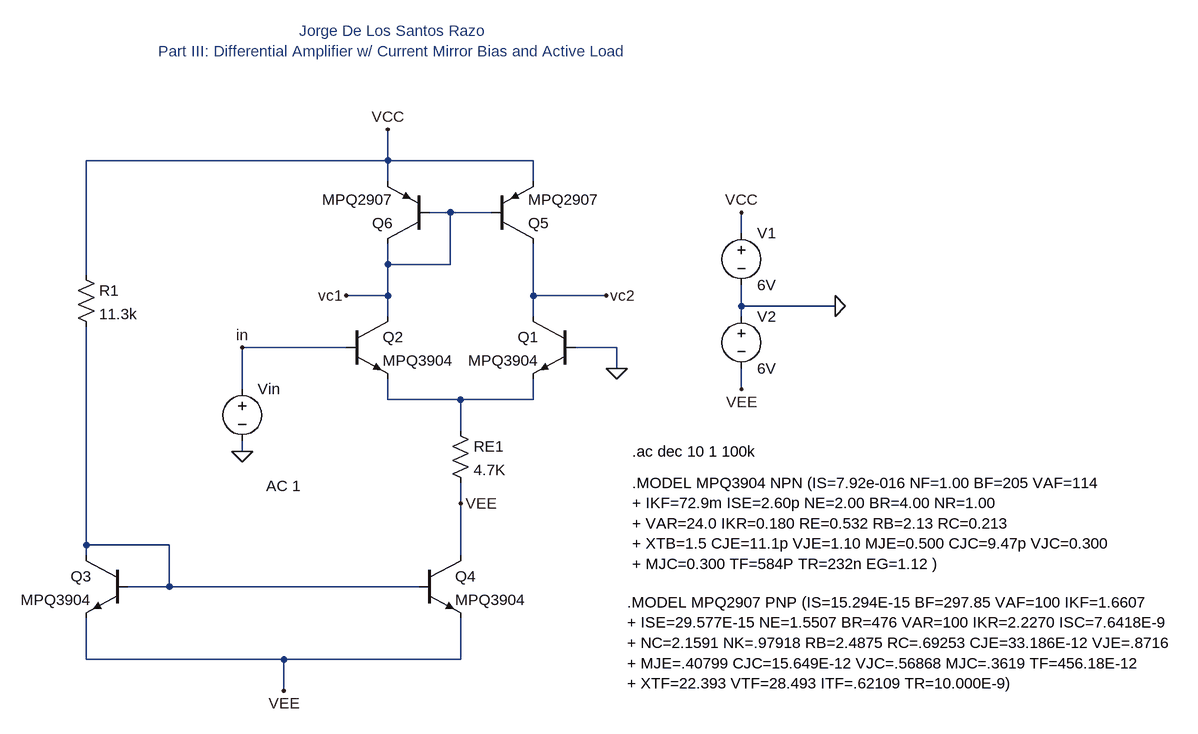
[diagram p0: schematic Diff-Amp-with-Current-Mirror-and-Active-Load.asc]
Diff-Amp-with-Current-Mirror-and-Active-Load.asc, the LTspice schematic file:
Version 4.1
SHEET 1 1960 920
WIRE 512 16 512 -32
WIRE 512 16 48 16
WIRE 736 16 512 16
WIRE 512 48 512 16
WIRE 736 48 736 16
WIRE 608 96 576 96
WIRE 672 96 608 96
WIRE 1056 128 1056 96
WIRE 512 176 512 144
WIRE 608 176 608 96
WIRE 608 176 512 176
WIRE 48 192 48 16
WIRE 512 224 512 176
WIRE 512 224 448 224
WIRE 736 224 736 144
WIRE 848 224 736 224
WIRE 1056 240 1056 208
WIRE 1200 240 1056 240
WIRE 512 256 512 224
WIRE 736 256 736 224
WIRE 1056 256 1056 240
WIRE 448 304 288 304
WIRE 864 304 800 304
WIRE 864 336 864 304
WIRE 288 368 288 304
WIRE 1056 368 1056 336
WIRE 512 384 512 352
WIRE 624 384 512 384
WIRE 736 384 736 352
WIRE 736 384 624 384
WIRE 624 432 624 384
WIRE 288 464 288 448
WIRE 624 544 624 512
WIRE 48 608 48 272
WIRE 176 608 48 608
WIRE 48 624 48 608
WIRE 624 624 624 544
WIRE 176 672 176 608
WIRE 176 672 112 672
WIRE 560 672 176 672
WIRE 48 784 48 720
WIRE 352 784 48 784
WIRE 624 784 624 720
WIRE 624 784 352 784
WIRE 352 832 352 784
FLAG 288 464 0
FLAG 624 544 VEE
FLAG 512 -32 VCC
FLAG 864 336 0
FLAG 1056 368 VEE
FLAG 1056 96 VCC
FLAG 1200 240 0
FLAG 448 224 vc1
FLAG 288 304 in
FLAG 848 224 vc2
FLAG 352 832 VEE
SYMBOL npn 800 256 M0
SYMATTR InstName Q1
SYMATTR Value MPQ3904
SYMBOL npn 448 256 R0
SYMATTR InstName Q2
SYMATTR Value MPQ3904
SYMBOL res 608 416 R0
SYMATTR InstName RE1
SYMATTR Value 4.7K
SYMBOL voltage 288 352 R0
WINDOW 3 37 137 Left 2
WINDOW 123 37 165 Left 2
WINDOW 39 0 0 Left 0
SYMATTR Value ""
SYMATTR Value2 AC 1
SYMATTR InstName Vin
SYMBOL voltage 1056 112 R0
SYMATTR InstName V1
SYMATTR Value 6V
SYMBOL voltage 1056 240 R0
SYMATTR InstName V2
SYMATTR Value 6V
SYMBOL npn 112 624 M0
SYMATTR InstName Q3
SYMATTR Value MPQ3904
SYMBOL npn 560 624 R0
SYMATTR InstName Q4
SYMATTR Value MPQ3904
SYMBOL res 32 176 R0
SYMATTR InstName R1
SYMATTR Value 11.3k
SYMBOL pnp 672 144 M180
SYMATTR InstName Q5
SYMATTR Value MPQ2907
SYMBOL pnp 576 144 R180
SYMATTR InstName Q6
SYMATTR Value MPQ2907
TEXT 888 512 Left 2 !.MODEL MPQ3904 NPN (IS=7.92e-016 NF=1.00 BF=205 VAF=114\n+ IKF=72.9m ISE=2.60p NE=2.00 BR=4.00 NR=1.00\n+ VAR=24.0 IKR=0.180 RE=0.532 RB=2.13 RC=0.213\n+ XTB=1.5 CJE=11.1p VJE=1.10 MJE=0.500 CJC=9.47p VJC=0.300\n+ MJC=0.300 TF=584P TR=232n EG=1.12 )
TEXT 520 -168 Center 2 ;Jorge De Los Santos Razo\nPart III: Differential Amplifier w/ Current Mirror Bias and Active Load
TEXT 888 464 Left 2 !.ac dec 10 1 100k
TEXT 880 696 Left 2 !.MODEL MPQ2907 PNP (IS=15.294E-15 BF=297.85 VAF=100 IKF=1.6607 \n+ ISE=29.577E-15 NE=1.5507 BR=476 VAR=100 IKR=2.2270 ISC=7.6418E-9\n+ NC=2.1591 NK=.97918 RB=2.4875 RC=.69253 CJE=33.186E-12 VJE=.8716\n+ MJE=.40799 CJC=15.649E-12 VJC=.56868 MJC=.3619 TF=456.18E-12\n+ XTF=22.393 VTF=28.493 ITF=.62109 TR=10.000E-9)

The netlist it stands for:
* Diff-Amp-with-Current-Mirror-and-Active-Load.asc
Q1 vc2 0 N001 0 MPQ3904
Q2 vc1 in N001 0 MPQ3904
RE1 N001 VEE 4.7K
Vin in 0 AC 1
V1 VCC 0 6V
V2 0 VEE 6V
Q3 N002 N002 VEE 0 MPQ3904
Q4 VEE N002 VEE 0 MPQ3904
R1 VCC N002 11.3k
Q5 vc2 vc1 VCC 0 MPQ2907
Q6 vc1 vc1 VCC 0 MPQ2907
.model NPN NPN
.model PNP PNP
.lib standard.bjt
.MODEL MPQ3904 NPN (IS=7.92e-016 NF=1.00 BF=205 VAF=114
+ IKF=72.9m ISE=2.60p NE=2.00 BR=4.00 NR=1.00
+ VAR=24.0 IKR=0.180 RE=0.532 RB=2.13 RC=0.213
+ XTB=1.5 CJE=11.1p VJE=1.10 MJE=0.500 CJC=9.47p VJC=0.300
+ MJC=0.300 TF=584P TR=232n EG=1.12 )
* Jorge De Los Santos Razo
* Part III: Differential Amplifier w/ Current Mirror Bias and Active Load
.ac dec 10 1 100k
.MODEL MPQ2907 PNP (IS=15.294E-15 BF=297.85 VAF=100 IKF=1.6607
+ ISE=29.577E-15 NE=1.5507 BR=476 VAR=100 IKR=2.2270 ISC=7.6418E-9
+ NC=2.1591 NK=.97918 RB=2.4875 RC=.69253 CJE=33.186E-12 VJE=.8716
+ MJE=.40799 CJC=15.649E-12 VJC=.56868 MJC=.3619 TF=456.18E-12
+ XTF=22.393 VTF=28.493 ITF=.62109 TR=10.000E-9)
.backanno
.end